# Altium project WiWi_USBStick.PrjPcb (part 1 of 5)
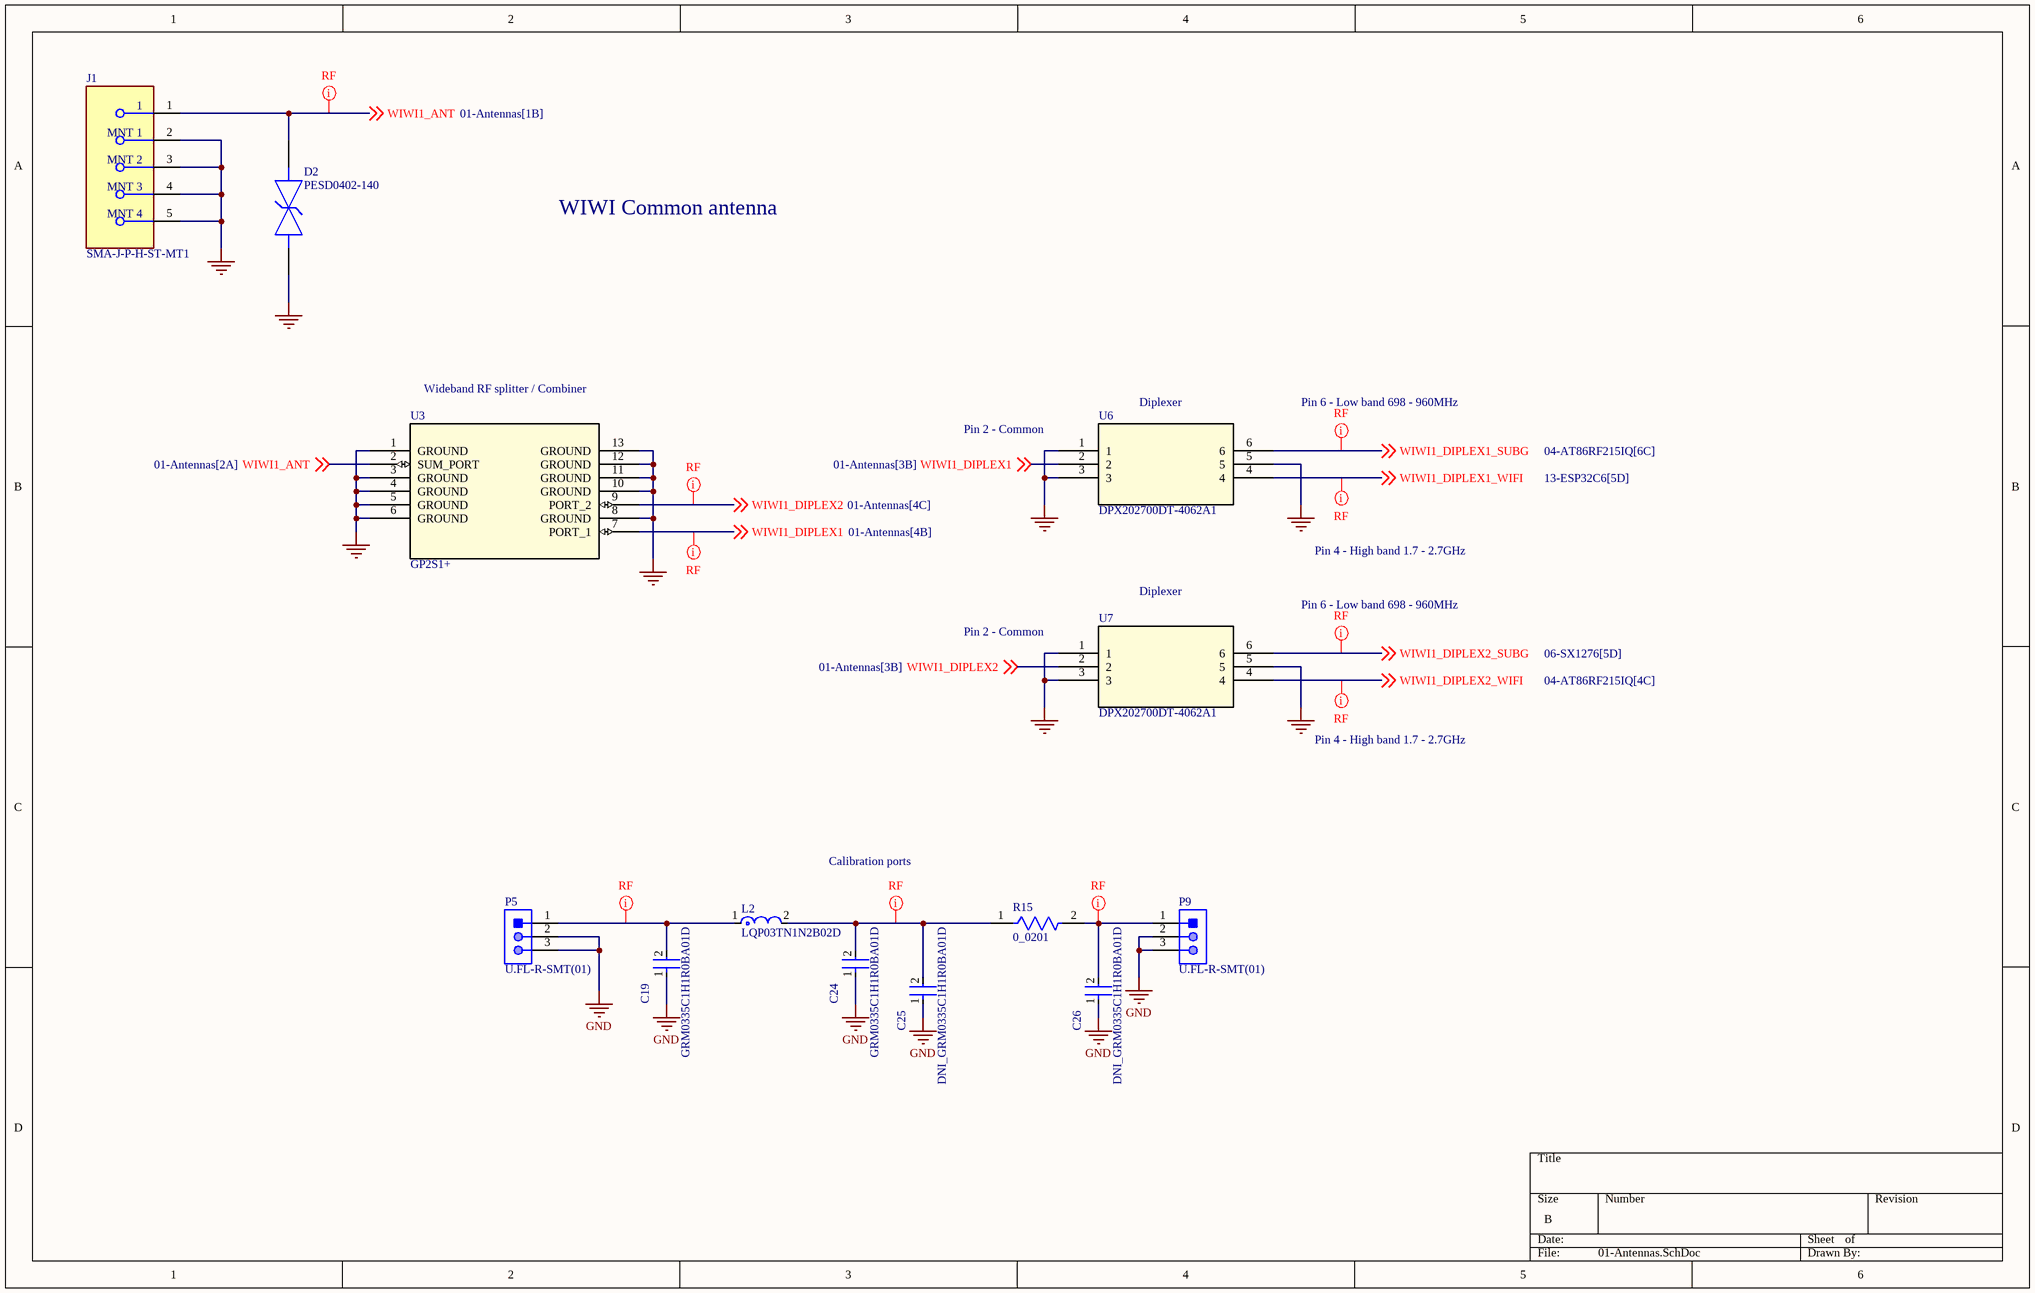
[diagram p0: 01-Antennas.SchDoc]
prjCompanyName: Meta Platforms Technologies, LLC.; prjContactAddress1: 9845 Willows Road NE; prjContactAddress2: Redmond, WA 98052; prjContactEmail: Contact Email; prjContactPhone: (...)-...-....; prjElectricalEngineer: Electical Engineer; prjElectricalEngineerEmail: Electical Engineer Email; prjLayoutEngineer: Layout Engineer; prjLayoutEngineerEmail: Layout Engineer Email; prjMechanicalEngineer: Mechanical Engineer; prjMechanicalEngineerEmail: Mechanical Engineer Email; prjPCB_IPN: 844-XXXXX-XX; prjPCB_Name: PCB Name; prjPCB_Revision: X1; prjProjectName: Project Name; prjSchematic_IPN: 846-XXXXX-XX; prjSchematic_Revision: X1; XprjPCBA_IPN: Set v_prjPCBA_IPN in variant parameters; XprjPCBA_Revision: Set v_prjPCBA_Revision in variant parameters
14 sheets, 599 parts. Net scope: global (net labels, ports and power ports of the same name join across sheets).
Board file: WiWi_USBStick_V1.PcbDoc
Sheets:
  01-Antennas.SchDoc
  02-USB3.SchDoc
  03-FT601.SchDoc
  04-USB2_Hub_BoardControlPeripherals.SchDoc
  04-AT86RF215IQ.SchDoc
  06-SX1276.SchDoc
  07-TCXO_Crystal.SchDoc
  13-ESP32C6.SchDoc
  14-DPLL_1.SchDoc
  15-DPLL_2.SchDoc
  16-ECP5_FPGA_1.SchDoc
  17-ECP5_FPGA_2.SchDoc
  11-Power.SchDoc
  12-FPGA_Power.SchDoc

## Sheet 01-Antennas.SchDoc
size B; SheetNumber: 1; SheetTotal: 14; SPICEModelCacheELOCFEDZ: <root> / <DocumentId>ELOCFEDZ</DocumentId> / </root>

### Parts
C19  GRM0335C1H1R0BA01D  [FP-GRM033-0_03-IPC_C]
C24  GRM0335C1H1R0BA01D  [FP-GRM033-0_03-IPC_C]
C25  DNI_GRM0335C1H1R0BA01D  [FP-GRM033-0_03-IPC_C]  (no BOM)
C26  DNI_GRM0335C1H1R0BA01D  [FP-GRM033-0_03-IPC_C]  (no BOM)
D2  PESD0402-140  [FP-PESD0402-MFG]
J1  SMA-J-P-H-ST-MT1  [FP-SMA-J-P-H-ST-MT1-MFG]
L2  LQP03TN1N2B02D  [FP-LQP03TG_02-IPC_A]
P5  U.FL-R-SMT(01)  [HRS-U.FL-R-SMT(10)_V]
P9  U.FL-R-SMT(01)  [HRS-U.FL-R-SMT(10)_V]
R15  0_0201  [FP-RC_L0201-MFG]
U3  GP2S1+  [DQ1225_MNC]
U6  DPX202700DT-4062A1  [RF_4060A1_TDK]
U7  DPX202700DT-4062A1  [RF_4060A1_TDK]

### Nets
GND: C19.1 C24.1 C25.1 C26.1 D2.1 J1.2(MNT_1) J1.3(MNT_2) J1.4(MNT_3) J1.5(MNT_4) P5.2 P5.3 P9.2 P9.3 U3.1(GROUND) U3.3(GROUND) U3.4(GROUND) U3.5(GROUND) U3.6(GROUND) U3.8(GROUND) U3.10(GROUND) U3.11(GROUND) U3.12(GROUND) U3.13(GROUND) U6.1 U6.3 U6.5 U7.1 U7.3 U7.5
WIWI1_ANT: D2.2 J1.1 U3.2(SUM_PORT) ; off-sheet WIWI1_ANT
WIWI1_DIPLEX1: U3.7(PORT_1) U6.2 ; off-sheet WIWI1_DIPLEX1
WIWI1_DIPLEX1_SUBG: U6.6 ; off-sheet WIWI1_DIPLEX1_SUBG
WIWI1_DIPLEX1_WIFI: U6.4 ; off-sheet WIWI1_DIPLEX1_WIFI
WIWI1_DIPLEX2: U3.9(PORT_2) U7.2 ; off-sheet WIWI1_DIPLEX2
WIWI1_DIPLEX2_SUBG: U7.6 ; off-sheet WIWI1_DIPLEX2_SUBG
WIWI1_DIPLEX2_WIFI: U7.4 ; off-sheet WIWI1_DIPLEX2_WIFI
NetC19_2: C19.2 L2.1 P5.1
NetC24_2: C24.2 C25.2 L2.2 R15.1
NetC26_2: C26.2 P9.1 R15.2

### Layout directives
net class RF: NetC19_2, NetC24_2, NetC26_2, WIWI1_ANT, WIWI1_DIPLEX1, WIWI1_DIPLEX1_SUBG, WIWI1_DIPLEX1_WIFI, WIWI1_DIPLEX2, WIWI1_DIPLEX2_SUBG, WIWI1_DIPLEX2_WIFI

### Notes on the sheet
- WIWI Common antenna
- Wideband RF splitter / Combiner
- (near U6) Pin 2 - Common
- (near U6) Diplexer
- Pin 6 - Low band 698 - 960MHz
- Pin 4 - High band 1.7 - 2.7GHz
- (near U7) Pin 2 - Common
- Diplexer
- Calibration ports

### Library data of the parts
C19 C24-C26 = CMP-2010-01509-2: Chip Multilayer Ceramic Capacitors for General Purpose, 0201, 1.0pF, C0G, 30ppm/°C, 0.1pF, 50V; Capacitance: 1pF; Termination: SMD/SMT; Depth: 0.3mm; Mount: Surface Mount; Case Code (Metric): 0603; Length: 0.024inch; Voltage Rating: 50V; Voltage Rating (DC): 50V; Width: 0.012inch; Lead Free: Lead Free; Dielectric: C0G; Thickness: 0.013inch; Packaging: Tape and Reel; Case Code (Imperial): 0201; Case/Package: 0201; Package Quantity: 15000; Min Operating Temperature: -55°C; Max Operating Temperature: 125°C
D2 = CMP-08607-000011-1: TVS DIODE 14V 40V 0402; Manufacturer: Littelfuse Inc.; Automotive Grade: Grade 1; Capacitance: 0.25pF; Value: 0.25pF; Direction: Bidirectional; Number Of Channels: 1; Temperature Range Low: -55°C; Lead Free: Yes; Temperature: -55°C to +125°C; Digikey Description: TVS DIODE 14V 40V 0402; Automotive: Yes; Device Class L2: TVS Diodes; Reverse Standoff Voltage: 14V; Device Class L1: Circuit Protection; Ipc Land Pattern Name: DIOC10050X33; Manufacturer Part Number: PESD0402-140; Breakdown Voltage: 14V; Height: 0.43mm; Clamping Voltage: 40V; RoHS: TRUE; Temperature Range High: +125°C; Device Class L3: unset; Octopart: https://octopart.com/pesd0402-140-littelfuse-74215061; Package: PESD0402; ComponentLink2URL: https://www.littelfuse.com/~/media/electronics/datasheets/polymer_esd_suppressors/littelfuse_polymer_esd_suppressor_pesd_catalog_datasheet.pdf.pdf; Category: Diode; ComponentLink2Description: Datasheet
J1 = CMP-02754-000007-1: CONN SMA JACK STR 50 OHM SMD; Dielectric Material: PTFE; Voltage Rating: 335V; Body Material: Brass; Center Contact Plating: Gold; Impedance: 50R; Number of Ports: 1; Max Frequency: 20GHz; Mount: Surface Mount; Contact Plating: Gold; Housing Color: Gold; Series: -; Fastening Type: Threaded; Packaging: Bulk; Connector Type: SMA; Contact Material: Copper Alloy; Body Plating: Gold; Case/Package: SMA; Termination: Solder; RoHS Compliant: No; Min Operating Temperature: -65°C; Max Operating Temperature: 125°C
L2 = CMP-06042-001577-1: Film type RF Inductor 1.2nH ±0.1nH 750mA 0.1Ω 0201 (0603); DC Resistance (DCR): 100mR; Current: 600mA; Core Material: Non-Magnetic; Shielding: Unshielded; Q Factor: 14; Test Frequency: 500MHz; Self Resonant Frequency: 6GHz; Inductance: 1.2nH; Mount: Surface Mount; Package Quantity: 15000; Length: 0.024inch; Resistor Type: Thin Film; Min Operating Temperature: -55°C; Depth: 0.33mm; Height: 0.012inch; Max DC Current: 750mA; Width: 0.012inch; Case/Package: 0201; Case Code (Imperial): 0201; Lead Free: Lead Free; Military Standard: Not; Termination: SMD/SMT; Max Operating Temperature: 125°C; DC Current: 750mA; Packaging: Tape and Reel; Case Code (Metric): 0603; Height - Seated (Max): 0.013inch; REACH SVHC: No SVHC; Radiation Hardening: No; Current Rating: 750mA
P5 P9 = CMP-2000-05151-1: CONN RECPT ULTRA-MINI COAX SMD; Manufacturer: Hirose Electric; Centre Contact Resistance: 25mohm; Voltage Rating V AC: 60V; Female Contact Material: PhosphorBronze; Contact Resistance: 10mohm; Male Contact Material: Brass; Connector Type: UFLCoaxial; Connector Mounting: PCB; Impedance: 50ohm; Insulation Resistance: 500Mohm; Secondary Insulation Material: PBT; Frequency Max: 6GHz; Body Plating: Silver; External Length / Height: 2.5mm; Approval Category: UL94V-0; Female Contact Plating: Gold; Connector Mounting Orientation: PCBoard; VSWR: 1.3; Coaxial Termination: Solder; Body Style: StraightJack; SVHC: NoSVHC(18-Jun-2012); Jacket Material: LCP; Package Reference: U.FL-R-SMT(10); Datasheet Version: Feb-04; Outer Contact Resistance: 10mohm; Contact Plating: Gold; Mounting Type: PCBoard; Flammability Rating: UL94V-0; Operating Frequency Max: 6GHz; Termination Method: Solder; Male Contact Plating: Gold; Package Description: 3-Pin Surface Mount Device, Body 2.6 x 2.6 mm; Operating Temperature Min: -40degC; Manufacturer URL: https://www.hirose.com; Operating Temperature Max: 90degC; Contact Material: PhosphorBronze; Datasheet URL: http://www.farnell.com/datasheets/91524.pdf; Material: PhosphorBronze
R15 = CMP-03412-023265-1: RES SMD 0 OHM JUMPER 1/20W 0201; Manufacturer: Yageo; Manufacturer Part Number: RC0201JR-070RL; Power Rating: 50mW; Value: 0Ω; Temperature Coefficient: 200ppm/°C; Voltage Rating: 25V; Tolerance: 5%; Octopart: https://octopart.com/rc0201jr-070rl-yageo-43171986; ComponentLink2URL: http://www.yageo.com/documents/recent/PYu-RC_Group_51_RoHS_L_10.pdf; Device Class L2: Resistors; Series: RC_L; Ipc Land Pattern Name: RESC6030X23; Temperature: -55°C to +125°C; Mouser Description: Thick Film Resistors ZERO OHM JUMPER; Footprint Url: http://www.yageo.com/exep/pages/download/literatures/PYu-R_Mount_10.pdf; RoHS: TRUE; Package: RC_L0201; Device Class L3: Chip SMD Resistors; Temperature Range Low: -55°C; Composition: Thick Film; ComponentLink2Description: Datasheet; Height: 0.26mm; Device Class L1: Passive Components; Category: Res; Resistance: 0Ω; Temperature Range High: +125°C; Automotive: No; Lead Free: Yes; Digikey Description: RES SMD 0 OHM JUMPER 1/20W 0201
U3 = GP2S1+: No Description Available; Mfr_Name: Mini Circuits; Type: RF; RefDes: RefDes
U6 U7 = DPX202700DT-4062A1: No Description Available; Mfr_Name: TDK; RefDes: RefDes; Type: Type

## Sheet 02-USB3.SchDoc
size B; SheetNumber: 2; SheetTotal: 14
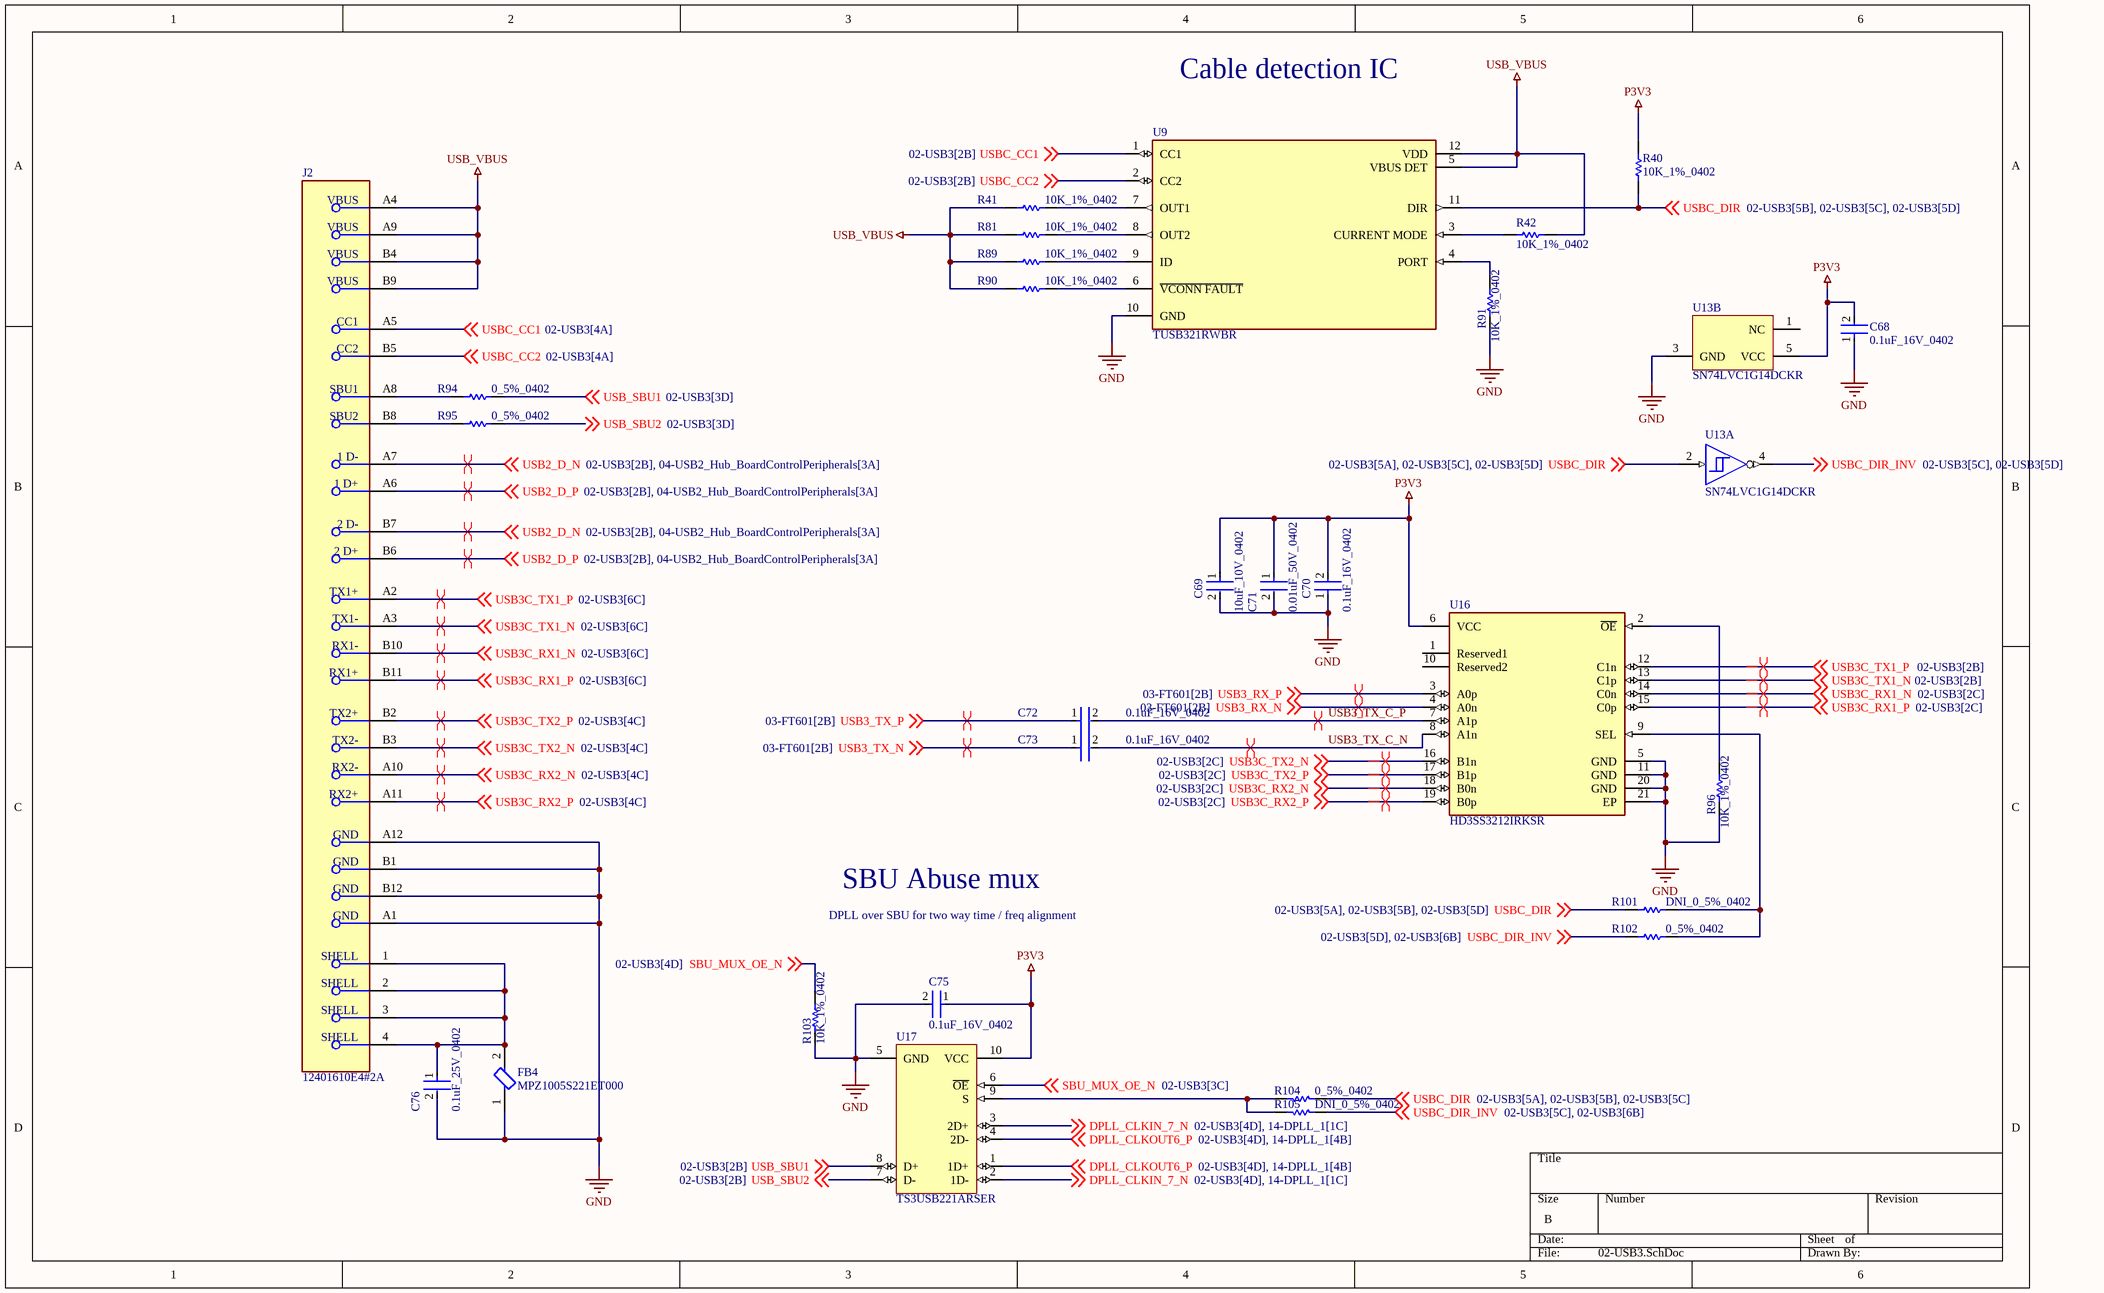
[diagram p1: 02-USB3.SchDoc]

### Parts
C68  0.1uF_16V_0402  [FP-C0402-BB-MFG]
C69  10uF_10V_0402  [FP-CL05A106MP5NUNC-MFG]
C70  0.1uF_16V_0402  [FP-C0402-BB-MFG]
C71  0.01uF_50V_0402  [FP-C0402-BB-MFG]
C72  0.1uF_16V_0402  [FP-C0402-BB-MFG]
C73  0.1uF_16V_0402  [FP-C0402-BB-MFG]
C75  0.1uF_16V_0402  [FP-C0402-BB-MFG]
C76  0.1uF_25V_0402  [FP-CGA2B-IPC_B]
FB4  MPZ1005S221ET000  [FP-MPZ1005-IPC_A]
J2  12401610E4#2A  [FP-12401610E4#2A-MFG]
R40  10K_1%_0402  [RESC1005X40X25NL10T10]
R41  10K_1%_0402  [RESC1005X40X25NL10T10]
R42  10K_1%_0402  [RESC1005X40X25NL10T10]
R81  10K_1%_0402  [RESC1005X40X25NL10T10]
R89  10K_1%_0402  [RESC1005X40X25NL10T10]
R90  10K_1%_0402  [RESC1005X40X25NL10T10]
R91  10K_1%_0402  [RESC1005X40X25NL10T10]
R94  0_5%_0402  [RESC1005X40X25NL05T10]
R95  0_5%_0402  [RESC1005X40X25NL05T10]
R96  10K_1%_0402  [RESC1005X40X25NL10T10]
R101  DNI_0_5%_0402  [RESC1005X40X25NL05T10]  (no BOM)
R102  0_5%_0402  [RESC1005X40X25NL05T10]
R103  10K_1%_0402  [RESC1005X40X25NL10T10]
R104  0_5%_0402  [RESC1005X40X25NL05T10]
R105  DNI_0_5%_0402  [RESC1005X40X25NL05T10]  (no BOM)
U9  TUSB321RWBR  [FP-RWB0012A-MFG]
U13  SN74LVC1G14DCKR  [DCK0005A_L]  (parts A,B of 2)
U16  HD3SS3212IRKSR  [FP-RKS0020A-MFG]
U17  TS3USB221ARSER  [RSE0010A_V]

### Nets
GND: C68.1 C69.2 C70.1 C71.2 C75.2 C76.2 FB4.1 J2.A1(GND) J2.A12(GND) J2.B1(GND) J2.B12(GND) R91.1 R96.1 R103.2 U9.10(GND) U13.3(GND) U16.5(GND) U16.11(GND) U16.20(GND) U16.21(EP) U17.5(GND)
P3V3: C68.2 C69.1 C70.2 C71.1 C75.1 R40.1 U13.5(VCC) U16.6(VCC) U17.10(VCC)
USB_VBUS: J2.A4(VBUS) J2.A9(VBUS) J2.B4(VBUS) J2.B9(VBUS) R41.2 R42.1 R81.2 R89.2 R90.2 U9.5(VBUS_DET) U9.12(VDD)
DPLL_CLKIN_7_N: U17.2(1D-) U17.3(2D+) ; off-sheet DPLL_CLKIN_7_N
DPLL_CLKOUT6_P: U17.1(1D+) U17.4(2D-) ; off-sheet DPLL_CLKOUT6_P
SBU_MUX_OE_N: R103.1 U17.6(~{OE}) ; off-sheet SBU_MUX_OE_N
USB2_D_N: J2.A7(1_D-) J2.B7(2_D-) ; off-sheet USB2_D_N
USB2_D_P: J2.A6(1_D+) J2.B6(2_D+) ; off-sheet USB2_D_P
USB3_RX_N: U16.4(A0n) ; off-sheet USB3_RX_N
USB3_RX_P: U16.3(A0p) ; off-sheet USB3_RX_P
USB3_TX_C_N: C73.2 U16.8(A1n)
USB3_TX_C_P: C72.2 U16.7(A1p)
USB3_TX_N: C73.1 ; off-sheet USB3_TX_N
USB3_TX_P: C72.1 ; off-sheet USB3_TX_P
USB3C_RX1_N: J2.B10(RX1-) U16.14(C0n) ; off-sheet USB3C_RX1_N
USB3C_RX1_P: J2.B11(RX1+) U16.15(C0p) ; off-sheet USB3C_RX1_P
USB3C_RX2_N: J2.A10(RX2-) U16.18(B0n) ; off-sheet USB3C_RX2_N
USB3C_RX2_P: J2.A11(RX2+) U16.19(B0p) ; off-sheet USB3C_RX2_P
USB3C_TX1_N: J2.A3(TX1-) U16.13(C1p) ; off-sheet USB3C_TX1_N
USB3C_TX1_P: J2.A2(TX1+) U16.12(C1n) ; off-sheet USB3C_TX1_P
USB3C_TX2_N: J2.B3(TX2-) U16.16(B1n) ; off-sheet USB3C_TX2_N
USB3C_TX2_P: J2.B2(TX2+) U16.17(B1p) ; off-sheet USB3C_TX2_P
USB_SBU1: R94.2 U17.8(D+) ; off-sheet USB_SBU1
USB_SBU2: R95.2 U17.7(D-) ; off-sheet USB_SBU2
USBC_CC1: J2.A5(CC1) U9.1(CC1) ; off-sheet USBC_CC1
USBC_CC2: J2.B5(CC2) U9.2(CC2) ; off-sheet USBC_CC2
USBC_DIR: R40.2 R101.1 R104.1 U9.11(DIR) U13.2(A) ; off-sheet USBC_DIR
USBC_DIR_INV: R102.1 R105.1 U13.4(Y) ; off-sheet USBC_DIR_INV
NetC76_1: C76.1 FB4.2 J2.1(SHELL) J2.2(SHELL) J2.3(SHELL) J2.4(SHELL)
NetJ2_A8: J2.A8(SBU1) R94.1
NetJ2_B8: J2.B8(SBU2) R95.1
NetR41_1: R41.1 U9.7(OUT1)
NetR42_2: R42.2 U9.3(CURRENT_MODE)
NetR81_1: R81.1 U9.8(OUT2)
NetR89_1: R89.1 U9.9(ID)
NetR90_1: R90.1 U9.6(~{VCONN_FAULT})
NetR91_2: R91.2 U9.4(PORT)
NetR96_2: R96.2 U16.2(~{OE})
NetR101_2: R101.2 R102.2 U16.9(SEL)
NetR104_2: R104.2 R105.2 U17.9(S)

Not connected (* = marked no-connect by the designer): U13 1(NC); U16 1(Reserved1) 10(Reserved2)

### Layout directives
differential pair: USB2_D_N, USB2_D_P, USB3_RX_N, USB3_RX_P, USB3_TX_C_N, USB3_TX_C_P, USB3_TX_N, USB3_TX_P, USB3C_RX1_N, USB3C_RX1_P, USB3C_RX2_N, USB3C_RX2_P, USB3C_TX1_N, USB3C_TX1_P, USB3C_TX2_N, USB3C_TX2_P

### Notes on the sheet
- Cable detection IC
- SBU Abuse mux
- DPLL over SBU for two way time / freq alignment

### Library data of the parts
C68 C70 C72 C73 C75 = CMP-1034-02068-3: CAP CER 0.1UF 16V 5% X7R 0402; Manufacturer: Kemet; Manufacturer Part Number: C0402C104J4RACTU; Value: 0.10 μF; Temperature Coefficient: 15%; Tolerance: 0.05; Material: Ceramic; ComponentLink2URL: https://content.kemet.com/datasheets/KEM_C1002_X7R_SMD.pdf; Automotive: No; Device Class L2: Capacitors; Temperature: -55°C to +125°C; RoHS: TRUE; Voltage Rating: 16 V; ComponentLink2Description: Datasheet; Device Class L3: Ceramic Capacitors; Temperature Range Low: -55°C; Ipc Land Pattern Name: CAPC10050X50; Device Class L1: Passive Components; Temperature Range High: +125°C; Package: C0402-BB; Capacitance: 0.10 μF; Category: Cap; Mouser Description: CAP CER 0.1UF 16V X7R 0402; Height: 0.55mm; Digikey Description: CAP CER 0.1UF 16V 5% X7R 0402; Octopart: https://octopart.com/c0402c104j4ractu-kemet-12573893; Temperature Characteristic: X7R; Lead Free: Yes
C69 = CMP-13271-000002-1: CAP CER 10UF 10V X5R 0402; Manufacturer Part Number: CL05A106MP5NUNC; Manufacturer: Samsung; Temperature Coefficient: 15%; Tolerance: 20%; Material: Ceramic; Octopart: https://octopart.com/cl05a106mp5nunc-samsung-22457395; Voltage Rating: 10V; RoHS: TRUE; Value: 10uF; Height: 0.7mm; Digikey Description: CAP CER 10UF 10V X5R 0402; Automotive: No; Package: CL05A106MP5NUNC; Device Class L1: Passive Components; Capacitance: 10uF; Temperature Range High: +85°C; ComponentLink2Description: Datasheet; Device Class L2: Capacitors; Temperature Characteristic: X5R; Temperature: -55°C to +85°C; ComponentLink2URL: http://www.samsungsem.com/kr/support/product-search/mlcc/__icsFiles/afieldfile/2019/05/10/19-CL05A106MP5NUNC.pdf; Device Class L3: Ceramic Capacitors; Category: Cap; Temperature Range Low: -55°C; Ipc Land Pattern Name: CAPC10050X50; Lead Free: Yes
C71 = CMP-2008-02109-2: CAP CER 10000PF 50V X7R 0402; Manufacturer: Kemet; Manufacturer Part Number: C0402C103K5RACTU; Temperature Coefficient: 15%; Tolerance: 0.1; Value: 10,000 pF; Material: Ceramic; Device Class L3: Ceramic Capacitors; Digikey Description: CAP CER 10000PF 50V X7R 0402; Height: 0.55mm; Temperature Range Low: -55°C; Package: C0402-BB; ComponentLink2URL: https://content.kemet.com/datasheets/KEM_C1002_X7R_SMD.pdf; Lead Free: Yes; Mouser Description: Capacitor; Ceramic; Cap; .010uF; Tol 10%; SMT; Vol-Rtg 50V; X7R; Tape and Reel; Ipc Land Pattern Name: CAPC10050X50; Temperature Range High: +125°C; Device Class L1: Passive Components; Category: Cap; Octopart: https://octopart.com/c0402c103k5ractu-kemet-95985; Temperature Characteristic: X7R; Automotive: No; Device Class L2: Capacitors; ComponentLink2Description: Datasheet; Voltage Rating: 50 V; Capacitance: 10,000 pF; RoHS: TRUE; Temperature: -55°C to +125°C
C76 = CMP-2000-06086-2: Cap Ceramic 100nF 25V X7R 10% Pad SMD 0402 +125°C Automotive T/R; Lead Free: Lead Free; Termination: SMD/SMT; Voltage Rating: 25V; Voltage: 25V; Composition: Ceramic; Case/Package: 0402; Mount: Surface Mount; Voltage Rating (DC): 25V; Tolerance: 10%; Length: 1mm; Width: 0.02inch; REACH SVHC: No SVHC; Max Operating Temperature: 125°C; Case Code (Metric): 1005; Case Code (Imperial): 0402; Package Quantity: 1; Depth: 0.5mm; Min Operating Temperature: -55°C; Thickness: 0.022inch; Capacitance: 100nF; Height: 0.5mm; Dielectric: X7R; Packaging: Tape and Reel; Weight: 2.3E-05oz; Ratings: AEC-Q200
FB4 = CMP-08257-000226-1: Power line Ferrite Bead 220Ω @ 100MHz 0.9A DCR 0.22Ω SMD 0402; Max Current Rating: 900mA; Impedance: 220R; Number of Lines: 1; DC Resistance (DCR): 220mR; Tolerance: 25%; Mount: Surface Mount; Case Code (Metric): 1005; Height: 0.022inch; Min Operating Temperature: -55°C; Max Operating Temperature: 125°C; RoHS Compliant: Yes; Length: 0.039inch; Width: 0.02inch; Case Code (Imperial): 0402; Case/Package: 0402; Package Quantity: 10000; Max DC Current: 900mA; Core Material: Ferrite; Packaging: Tape and Reel
J2 = CMP-02355-000003-1: CONN RCP USB3.1 TYPEC 24P SMD RA; Connector Type: USB; Number of Contacts: 24; Gender: Receptacle; Packaging: Cut Tape; Mount: Surface Mount; Number of Pins: 24
R40-R42 R81 R89-R91 R96 R103 = CMP-2002-04694-1: Manufacturer: Bourns; Part Number: CR0402-FX-1002GLF
R94 R95 R101 R102 R104 R105 = CMP-2002-06457-1: Manufacturer: Panasonic; Part Number: ERJ-U020R00X
U9 = CMP-04877-000009-1: IC INTERFACE SPECIALIZED 12X2QFN; Number of Ports: 1; Max Supply Voltage: 5.5V; Min Supply Voltage: 4.5V; USB Standard: USB 3.1; Max Operating Temperature: 70°C; Mount: Surface Mount; Number of Pins: 12; Lead Free: Lead Free; Min Operating Temperature: 0°C; REACH SVHC: No SVHC; Packaging: Tape and Reel; RoHS Compliant: Yes; Contact Plating: Gold
U13 = CMP-0859-00440-4: Single Schmitt-Trigger Inverter, DCK0005A, LARGE T&R; Manufacturer: Texas Instruments; Output Drive (IOL/IOH)(Max)(mA): 32/-32; Schmitt Trigger: Yes; Logic: Inverting; Bits(#): 1; Rating: Catalog; tpd @ Nom Voltage(Max)(ns): 11,6.5,5.5,5; Voltage(Nom)(V): 1.8,2.5,3.3,5; Output Type: CMOS; VCC(Min)(V): 1.65; ICC @ Nom Voltage(Max)(mA): 0.01; Input Type: CMOS/TTL; F @ Nom Voltage(Max)(Mhz): 150; VCC(Max)(V): 5.5; Sub-Family: Inverting Buffer/Driver; 3-State Output: No; Technology Family: LVC; PackageReference: DCK0005A; Operating Temperature Range(C): -40 to 125,-40 to 85; Generic Part Number: SN74LVC1G14; DatasheetVersion: SCES218W
U16 = CMP-04877-000012-1: IC MUX 2:1 8 OHM 20VQFN; USB Standard: USB 3.1; Min Supply Voltage: 3V; Max Supply Voltage: 3.6V; Data Rate: 480Mbps; Number of Ports: 2; Bandwidth: 8GHz; REACH SVHC: No SVHC; Lead Free: Lead Free; Max Operating Temperature: 85°C; Packaging: Tape and Reel; Case/Package: VQFN; Number of Pins: 20; Min Operating Temperature: -40°C
U17 = CMP-0309-00017-2: ESD Protected,High-Speed USB 2.0 (480-Mbps) 1:2 Multiplexer / Demultiplexer Switch, 1:2 Mux / Demux, 6 ohm RON, 2.5 to 3.3V, -40 to 85 degC, 10-Pin UQFN (RSE), Green (RoHS & no Sb/Br); Manufacturer: Texas Instruments; tpd max(ns): 0.25; RON Mis-match(Max)(Ohms): 0.2; OFF Time(Max)(ns): 12; Architecture: "1","2 mux/demux"; IL OFF(Max)(nA): 2; SubFamily: USB Switch; ESD HBM(kV): +/-7; ron(max)(ohms): 6; ON Time(Max)(ns): 30; Bandwidth(MHz): 900; RON Flatness(Max)(Ohms): 1; Vcc range(V): 2.3 to 3.6; Mounting Technology: Surface Mount; ComponentLink2URL: http://www.ti.com/lit/ml/mpqf186c/mpqf186c.pdf; PackageDescription: 10-Leads Plastic Quad Flatpack No-Lead, 2 x 1.5 x 0.55 mm Body, 0.5 mm Pitch; ComponentLink1URL: http://www.ti.com/general/docs/lit/getliterature.tsp?genericPartNumber=TS3USB221A&fileType=pdf; PackageReference: RSE0010A; ComponentLink2Description: Package Specification; PartNumber: TS3USB221ARSER; Code_JEDEC: MO-288-UEFD; DatasheetVersion: SCDS277; ComponentLink1Description: Datasheet; Eco-Plan: Green (RoHS & no Sb/Br); Number of Channels: 2; PackageVersion: revD, Jan-2011; ICC(uA): 30

## Sheet 03-FT601.SchDoc
size B; SheetNumber: 3; SheetTotal: 14
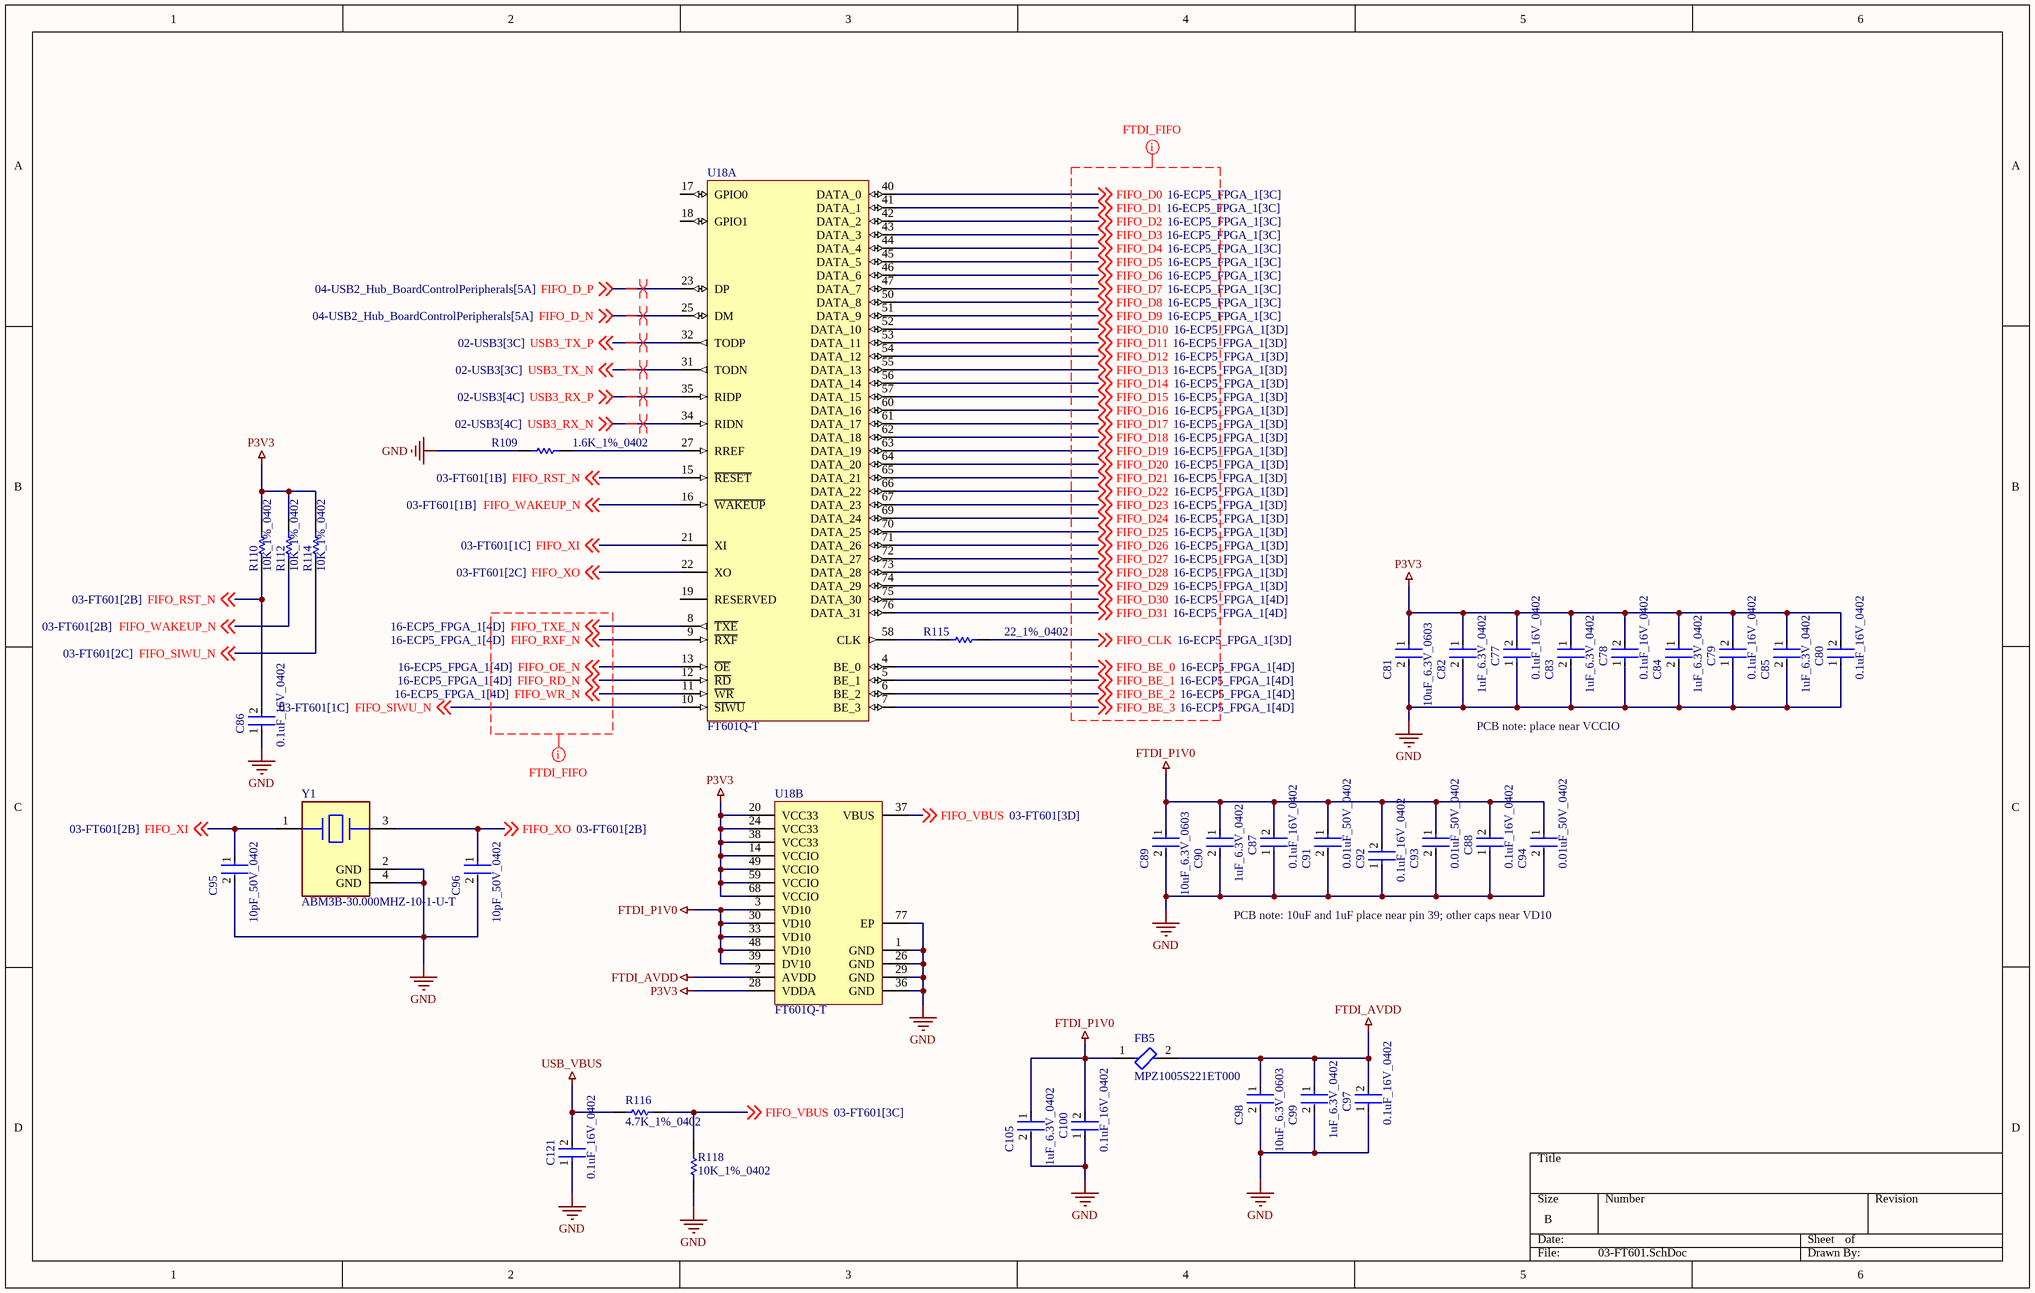
[diagram p2: 03-FT601.SchDoc]

### Parts
C77  0.1uF_16V_0402  [FP-C0402-BB-MFG]
C78  0.1uF_16V_0402  [FP-C0402-BB-MFG]
C79  0.1uF_16V_0402  [FP-C0402-BB-MFG]
C80  0.1uF_16V_0402  [FP-C0402-BB-MFG]
C81  10uF_6.3V_0603  [FP-GRM188-0_1-e0_2_0_55-IPC_A]
C82  1uF_6.3V_0402  [FP-CC0402-MFG]
C83  1uF_6.3V_0402  [FP-CC0402-MFG]
C84  1uF_6.3V_0402  [FP-CC0402-MFG]
C85  1uF_6.3V_0402  [FP-CC0402-MFG]
C86  0.1uF_16V_0402  [FP-C0402-BB-MFG]
C87  0.1uF_16V_0402  [FP-C0402-BB-MFG]
C88  0.1uF_16V_0402  [FP-C0402-BB-MFG]
C89  10uF_6.3V_0603  [FP-GRM188-0_1-e0_2_0_55-IPC_A]
C90  1uF_6.3V_0402  [FP-CC0402-MFG]
C91  0.01uF_50V_0402  [FP-C0402-BB-MFG]
C92  0.1uF_16V_0402  [FP-C0402-BB-MFG]
C93  0.01uF_50V_0402  [FP-C0402-BB-MFG]
C94  0.01uF_50V_0402  [FP-C0402-BB-MFG]
C95  10pF_50V_0402  [FP-C0402-BB-MFG]
C96  10pF_50V_0402  [FP-C0402-BB-MFG]
C97  0.1uF_16V_0402  [FP-C0402-BB-MFG]
C98  10uF_6.3V_0603  [FP-GRM188-0_1-e0_2_0_55-IPC_A]
C99  1uF_6.3V_0402  [FP-CC0402-MFG]
C100  0.1uF_16V_0402  [FP-C0402-BB-MFG]
C105  1uF_6.3V_0402  [FP-CC0402-MFG]
C121  0.1uF_16V_0402  [FP-C0402-BB-MFG]
FB5  MPZ1005S221ET000  [FP-MPZ1005-IPC_A]
R109  1.6K_1%_0402  [RESC1005X40X25LL05T05]
R110  10K_1%_0402  [RESC1005X40X25NL10T10]
R112  10K_1%_0402  [RESC1005X40X25NL10T10]
R114  10K_1%_0402  [RESC1005X40X25NL10T10]
R115  22_1%_0402  [RESC1005X40X25ML05T05]
R116  4.7K_1%_0402  [RESC1005X40X25NL05T10]
R118  10K_1%_0402  [RESC1005X40X25NL10T10]
U18  FT601Q-T  [FTDI-QFN-76_M]  (parts A,B of 2)
Y1  ABM3B-30.000MHZ-10-1-U-T  [FP-ABM3B-MFG]

### Nets
FTDI_AVDD: C97.2 C98.1 C99.1 FB5.2 U18.2(AVDD)
FTDI_P1V0: C87.2 C88.2 C89.1 C90.1 C91.1 C92.2 C93.1 C94.1 C100.2 C105.1 FB5.1 U18.3(VD10) U18.30(VD10) U18.33(VD10) U18.39(DV10) U18.48(VD10)
GND: C77.1 C78.1 C79.1 C80.1 C81.2 C82.2 C83.2 C84.2 C85.2 C86.1 C87.1 C88.1 C89.2 C90.2 C91.2 C92.1 C93.2 C94.2 C95.2 C96.2 C97.1 C98.2 C99.2 C100.1 C105.2 C121.1 R109.1 R118.2 U18.1(GND) U18.26(GND) U18.29(GND) U18.36(GND) U18.77(EP) Y1.2(GND) Y1.4(GND)
P3V3: C77.2 C78.2 C79.2 C80.2 C81.1 C82.1 C83.1 C84.1 C85.1 R110.1 R112.1 R114.1 U18.14(VCCIO) U18.20(VCC33) U18.24(VCC33) U18.28(VDDA) U18.38(VCC33) U18.49(VCCIO) U18.59(VCCIO) U18.68(VCCIO)
USB_VBUS: C121.2 R116.1
FIFO_BE_0: U18.4(BE_0) ; off-sheet FIFO_BE_0
FIFO_BE_1: U18.5(BE_1) ; off-sheet FIFO_BE_1
FIFO_BE_2: U18.6(BE_2) ; off-sheet FIFO_BE_2
FIFO_BE_3: U18.7(BE_3) ; off-sheet FIFO_BE_3
FIFO_CLK: R115.2 ; off-sheet FIFO_CLK
FIFO_D0: U18.40(DATA_0) ; off-sheet FIFO_D0
FIFO_D1: U18.41(DATA_1) ; off-sheet FIFO_D1
FIFO_D2: U18.42(DATA_2) ; off-sheet FIFO_D2
FIFO_D3: U18.43(DATA_3) ; off-sheet FIFO_D3
FIFO_D4: U18.44(DATA_4) ; off-sheet FIFO_D4
FIFO_D5: U18.45(DATA_5) ; off-sheet FIFO_D5
FIFO_D6: U18.46(DATA_6) ; off-sheet FIFO_D6
FIFO_D7: U18.47(DATA_7) ; off-sheet FIFO_D7
FIFO_D8: U18.50(DATA_8) ; off-sheet FIFO_D8
FIFO_D9: U18.51(DATA_9) ; off-sheet FIFO_D9
FIFO_D10: U18.52(DATA_10) ; off-sheet FIFO_D10
FIFO_D11: U18.53(DATA_11) ; off-sheet FIFO_D11
FIFO_D12: U18.54(DATA_12) ; off-sheet FIFO_D12
FIFO_D13: U18.55(DATA_13) ; off-sheet FIFO_D13
FIFO_D14: U18.56(DATA_14) ; off-sheet FIFO_D14
FIFO_D15: U18.57(DATA_15) ; off-sheet FIFO_D15
FIFO_D16: U18.60(DATA_16) ; off-sheet FIFO_D16
FIFO_D17: U18.61(DATA_17) ; off-sheet FIFO_D17
FIFO_D18: U18.62(DATA_18) ; off-sheet FIFO_D18
FIFO_D19: U18.63(DATA_19) ; off-sheet FIFO_D19
FIFO_D20: U18.64(DATA_20) ; off-sheet FIFO_D20
FIFO_D21: U18.65(DATA_21) ; off-sheet FIFO_D21
FIFO_D22: U18.66(DATA_22) ; off-sheet FIFO_D22
FIFO_D23: U18.67(DATA_23) ; off-sheet FIFO_D23
FIFO_D24: U18.69(DATA_24) ; off-sheet FIFO_D24
FIFO_D25: U18.70(DATA_25) ; off-sheet FIFO_D25
FIFO_D26: U18.71(DATA_26) ; off-sheet FIFO_D26
FIFO_D27: U18.72(DATA_27) ; off-sheet FIFO_D27
FIFO_D28: U18.73(DATA_28) ; off-sheet FIFO_D28
FIFO_D29: U18.74(DATA_29) ; off-sheet FIFO_D29
FIFO_D30: U18.75(DATA_30) ; off-sheet FIFO_D30
FIFO_D31: U18.76(DATA_31) ; off-sheet FIFO_D31
FIFO_D_N: U18.25(DM) ; off-sheet FIFO_D_N
FIFO_D_P: U18.23(DP) ; off-sheet FIFO_D_P
FIFO_OE_N: U18.13(~{OE}) ; off-sheet FIFO_OE_N
FIFO_RD_N: U18.12(~{RD}) ; off-sheet FIFO_RD_N
FIFO_RST_N: C86.2 R110.2 U18.15(~{RESET}) ; off-sheet FIFO_RST_N
FIFO_RXF_N: U18.9(~{RXF}) ; off-sheet FIFO_RXF_N
FIFO_SIWU_N: R114.2 U18.10(~{SIWU}) ; off-sheet FIFO_SIWU_N
FIFO_TXE_N: U18.8(~{TXE}) ; off-sheet FIFO_TXE_N
FIFO_VBUS: R116.2 R118.1 U18.37(VBUS) ; off-sheet FIFO_VBUS
FIFO_WAKEUP_N: R112.2 U18.16(~{WAKEUP}) ; off-sheet FIFO_WAKEUP_N
FIFO_WR_N: U18.11(~{WR}) ; off-sheet FIFO_WR_N
FIFO_XI: C95.1 U18.21(XI) Y1.1 ; off-sheet FIFO_XI
FIFO_XO: C96.1 U18.22(XO) Y1.3 ; off-sheet FIFO_XO
USB3_RX_N: U18.34(RIDN) ; off-sheet USB3_RX_N
USB3_RX_P: U18.35(RIDP) ; off-sheet USB3_RX_P
USB3_TX_N: U18.31(TODN) ; off-sheet USB3_TX_N
USB3_TX_P: U18.32(TODP) ; off-sheet USB3_TX_P
NetR109_2: R109.2 U18.27(RREF)
NetR115_1: R115.1 U18.58(CLK)

Not connected (* = marked no-connect by the designer): U18 17(GPIO0) 18(GPIO1) 19(RESERVED)

### Layout directives
mark named FTDI_FIFO: FIFO_BE_0, FIFO_BE_1, FIFO_BE_2, FIFO_BE_3, FIFO_CLK, FIFO_D0, FIFO_D1, FIFO_D2, FIFO_D3, FIFO_D4, FIFO_D5, FIFO_D6, FIFO_D7, FIFO_D8, FIFO_D9, FIFO_D10, FIFO_D11, FIFO_D12, FIFO_D13, FIFO_D14, FIFO_D15, FIFO_D16, FIFO_D17, FIFO_D18, FIFO_D19, FIFO_D20, FIFO_D21, FIFO_D22, FIFO_D23, FIFO_D24, FIFO_D25, FIFO_D26, FIFO_D27, FIFO_D28, FIFO_D29, FIFO_D30, FIFO_D31, FIFO_OE_N, FIFO_RD_N, FIFO_RXF_N, FIFO_TXE_N, FIFO_WR_N
differential pair: FIFO_D_N, FIFO_D_P, USB3_RX_N, USB3_RX_P, USB3_TX_N, USB3_TX_P

### Notes on the sheet
- PCB note: place near VCCIO
- PCB note: 10uF and 1uF place near pin 39; other caps near VD10

### Library data of the parts
C77-C80 C86-C88 C92 C97 C100 C121 = CMP-1034-02068-3: as C68 on sheet 02-USB3; ComponentLink2URL: https://content.kemet.com/datasheets/KEM_C1002_X7R_SMD.pdf; Automotive: No; Device Class L2: Capacitors; Temperature: -55°C to +125°C; RoHS: TRUE; Voltage Rating: 16 V; ComponentLink2Description: Datasheet; Device Class L3: Ceramic Capacitors; Temperature Range Low: -55°C; Ipc Land Pattern Name: CAPC10050X50; Device Class L1: Passive Components; Temperature Range High: +125°C; Package: C0402-BB; Capacitance: 0.10 μF; Category: Cap; Mouser Description: CAP CER 0.1UF 16V X7R 0402; Height: 0.55mm; Digikey Description: CAP CER 0.1UF 16V 5% X7R 0402; Octopart: https://octopart.com/c0402c104j4ractu-kemet-12573893; Temperature Characteristic: X7R; Lead Free: Yes
C81 C89 C98 = CMP-2006-02792-2: Chip Multilayer Ceramic Capacitors for General Purpose, 0603, 10uF, X5R, 15%, 20%, 6.3V; Packaging: Tape and Reel; Voltage Rating (DC): 6.3V; Width: 0.031inch; Termination: SMD/SMT; Dielectric: X5R; Package Quantity: 4000; Voltage Rating: 6.3V; Capacitance: 10uF; Case/Package: 0603; Min Operating Temperature: -55°C; Voltage: 6.3V; Length: 1.6mm; Thickness: 0.035inch; Lead Free: Lead Free; Depth: 0.8mm; Case Code (Imperial): 0603; Max Operating Temperature: 85°C; Material: Ceramic; Height: 0.8mm; Tolerance: 20%; Mount: Surface Mount; REACH SVHC: No SVHC; Radiation Hardening: No; Case Code (Metric): 1608
C82-C85 C90 C99 C105 = CMP-2100-03591-2: CAP CER 1UF 6.3V X5R 0402; Manufacturer: YAGEO; Manufacturer Part Number: CC0402KRX5R5BB105; Automotive Grade: NA; Material: Ceramic; Tolerance: 0.1; Temperature Coefficient: 30ppm/°C; Voltage Rating: 6.3 V; Temperature Range Low: -55°C; Digikey Description: CAP CER 1UF 6.3V X5R 0402; Capacitance: 1 uF; Height: 0.55mm; Automotive: No; ComponentLink2URL: http://www.yageo.com/documents/recent/UPY-GP_NP0_16V-to-50V_16.pdf; Device Class L2: Capacitors; RoHS: TRUE; Temperature Range High: +125°C; Device Class L3: Ceramic Capacitors; Device Class L1: Passive Components; Temperature Characteristic: X5R; Package: CC0402; Octopart: https://octopart.com/cc0402krx5r5bb105-yageo-42244618; ComponentLink2Description: Datasheet; Temperature: -55°C to +125°C; Mouser Description: Multilayer Ceramic Capacitors MLCC - SMD/SMT 1uF 6.3V X5R 10%; Category: Cap; Footprint Url: http://www.yageo.com/exep/pages/download/literatures/UPY-C_GEN_24.pdf; Lead Free: Yes; Ipc Land Pattern Name: CAPC10050X50; Value: 1 uF
C91 C93 C94 = CMP-2008-02109-2: as C71 on sheet 02-USB3; Device Class L3: Ceramic Capacitors; Digikey Description: CAP CER 10000PF 50V X7R 0402; Height: 0.55mm; Temperature Range Low: -55°C; Package: C0402-BB; ComponentLink2URL: https://content.kemet.com/datasheets/KEM_C1002_X7R_SMD.pdf; Lead Free: Yes; Mouser Description: Capacitor; Ceramic; Cap; .010uF; Tol 10%; SMT; Vol-Rtg 50V; X7R; Tape and Reel; Ipc Land Pattern Name: CAPC10050X50; Temperature Range High: +125°C; Device Class L1: Passive Components; Category: Cap; Octopart: https://octopart.com/c0402c103k5ractu-kemet-95985; Temperature Characteristic: X7R; Automotive: No; Device Class L2: Capacitors; ComponentLink2Description: Datasheet; Voltage Rating: 50 V; Capacitance: 10,000 pF; RoHS: TRUE; Temperature: -55°C to +125°C
C95 C96 = CMP-2008-03404-2: Multilayer Ceramic Capacitor, C Series, 10 Pf, - 5%, C0G / Np0, 50 V, 0402 [1005 Metric] Rohs Compliant: Yes; Manufacturer Part Number: C0402C100J5GACTU; Manufacturer: Kemet; Temperature Coefficient: 15%; Voltage Rating: 50 V; Capacitance: 10 pF; Value: 10 pF; Tolerance: 0.05; Automotive: No; Temperature Range High: +125°C; ComponentLink2Description: Datasheet; Material: Ceramic; Lead Free: Yes; ComponentLink2URL: https://content.kemet.com/datasheets/KEM_C1002_X7R_SMD.pdf; Device Class L3: Ceramic Capacitors; RoHS: TRUE; Package: C0402-BB; Temperature: -55°C to +125°C; Temperature Range Low: -55°C; Height: 0.55mm; Mouser Description: Multilayer Ceramic Capacitor, C Series, 10 Pf, - 5%, C0G / Np0, 50 V, 0402 [1005 Metric] Rohs Compliant: Yes; Octopart: https://octopart.com/c0402c100j5gactu-kemet-108448; Digikey Description: Multilayer Ceramic Capacitor, C Series, 10 Pf, - 5%, C0G / Np0, 50 V, 0402 [1005 Metric] Rohs Compliant: Yes; Temperature Characteristic: C0G; Category: Cap; Ipc Land Pattern Name: CAPC10050X50; Device Class L1: Passive Components; Device Class L2: Capacitors
FB5 = CMP-08257-000226-1: as FB4 on sheet 02-USB3; Mount: Surface Mount; Case Code (Metric): 1005; Height: 0.022inch; Min Operating Temperature: -55°C; Max Operating Temperature: 125°C; RoHS Compliant: Yes; Length: 0.039inch; Width: 0.02inch; Case Code (Imperial): 0402; Case/Package: 0402; Package Quantity: 10000; Max DC Current: 900mA; Core Material: Ferrite; Packaging: Tape and Reel
R109 = CMP-2002-00708-1: Manufacturer: Panasonic; Part Number: ERJ-2RKF1601X
R110 R112 R114 R118 = CMP-2002-04694-1: as R40 on sheet 02-USB3
R115 = CMP-2002-01135-4: Chip Resistor, 22 Ohm, +/- 1%, 0.1 W, -55 to 155 degC, 0402 (1005 Metric), RoHS, Tape and Reel; PartNumber: ERJ-2RKF22R0X; Case\/Package: 0402; Resistance: 22 Ohm; Power Rating: 100 mW; Voltage Rating: 50 V; ComponentLink2Description: Datasheet; Packaging: Tape and Reel; Weight: 2.8E-05oz; Pins: 2; Case Code (Imperial): 0402; Width: 0.5 mm; ComponentLink2URL: http://industrial.panasonic.com/cdbs/www-data/pdf/RDA0000/AOA0000C86.pdf; Height: 0.35 mm; PackageReference: 0402; REACH SVHC: Yes; Min Operating Temperature: -55 degC; Length: 1 mm; DatasheetVersion: 04/2015; RoHSCompliant: true; Package Quantity: 10000; Case Code (Metric): 1005; PackageDescription: 2-Pin Surface Mount Device, Body 1 x 0.5 mm; ComponentLink1URL: http://www.panasonic.com/; Mount: Surface Mount; Mounting Technology: Surface Mount; Tolerance: 1%; Max Operating Temperature: 155 degC; ComponentLink1Description: Manufacturer URL
R116 = CMP-1011-00586-2: Manufacturer: Yageo / Phycomp; Part Number: RC0402FR-074K7L
U18 = CMP-1736-00001-1: 32 Bit USB 3.0 to FIFO Bridge, 5 Gbps, 3 to 3.6 V, -40 to 85 degC, 76-Pin QFN, Pb-Free, Tray; ComponentLink2Description: Datasheet; Mounting Technology: Surface Mount; ComponentLink1Description: Manufacturer URL; Case/Package: QFN; RoHSCompliant: false; PackageDescription: 76-Pin Quad Flat No-lead Package, Body 9 x 9 mm, Pitch 0.4 mm, Thermal Pad 5.45 x 5.45 mm; ComponentLink2URL: http://www.ftdichip.com/Support/Documents/DataSheets/ICs/DS_FT600Q-FT601Q%20IC%20Datasheet.pdf; DatasheetVersion: Rev. 1.02, 02/2016; PartNumber: FT601Q-T; ComponentLink1URL: http://www.ftdichip.com/
Y1 = CMP-27762-014122-1: Crystal 30MHz ±10ppm 10pF SMD-4 5mm x 3.2mm; ESR (Equivalent Series Resistance): 50R; Packaging: Tape and Reel; Series: ABM3B; Resistor Type: Ceramic; Tolerance: 10ppm; Radiation Hardening: No; Mount: Surface Mount; Max Operating Temperature: 60°C; Operating Frequency: 30 MHz; Min Operating Temperature: -10°C; Length: 5mm; Height: 0.043inch; Frequency: 30MHz; Number of Pins: 4; Frequency Stability: 10ppm; Frequency Tolerance: 10ppm; Case/Package: CSMD; Lead Free: Lead Free; Depth: 3.2mm; Termination: SMD/SMT; Load Capacitance: 10pF; Package Quantity: 1000; Width: 0.126inch

## Sheet 04-USB2_Hub_BoardControlPeripherals.SchDoc
size B; SheetNumber: 4; SheetTotal: 14
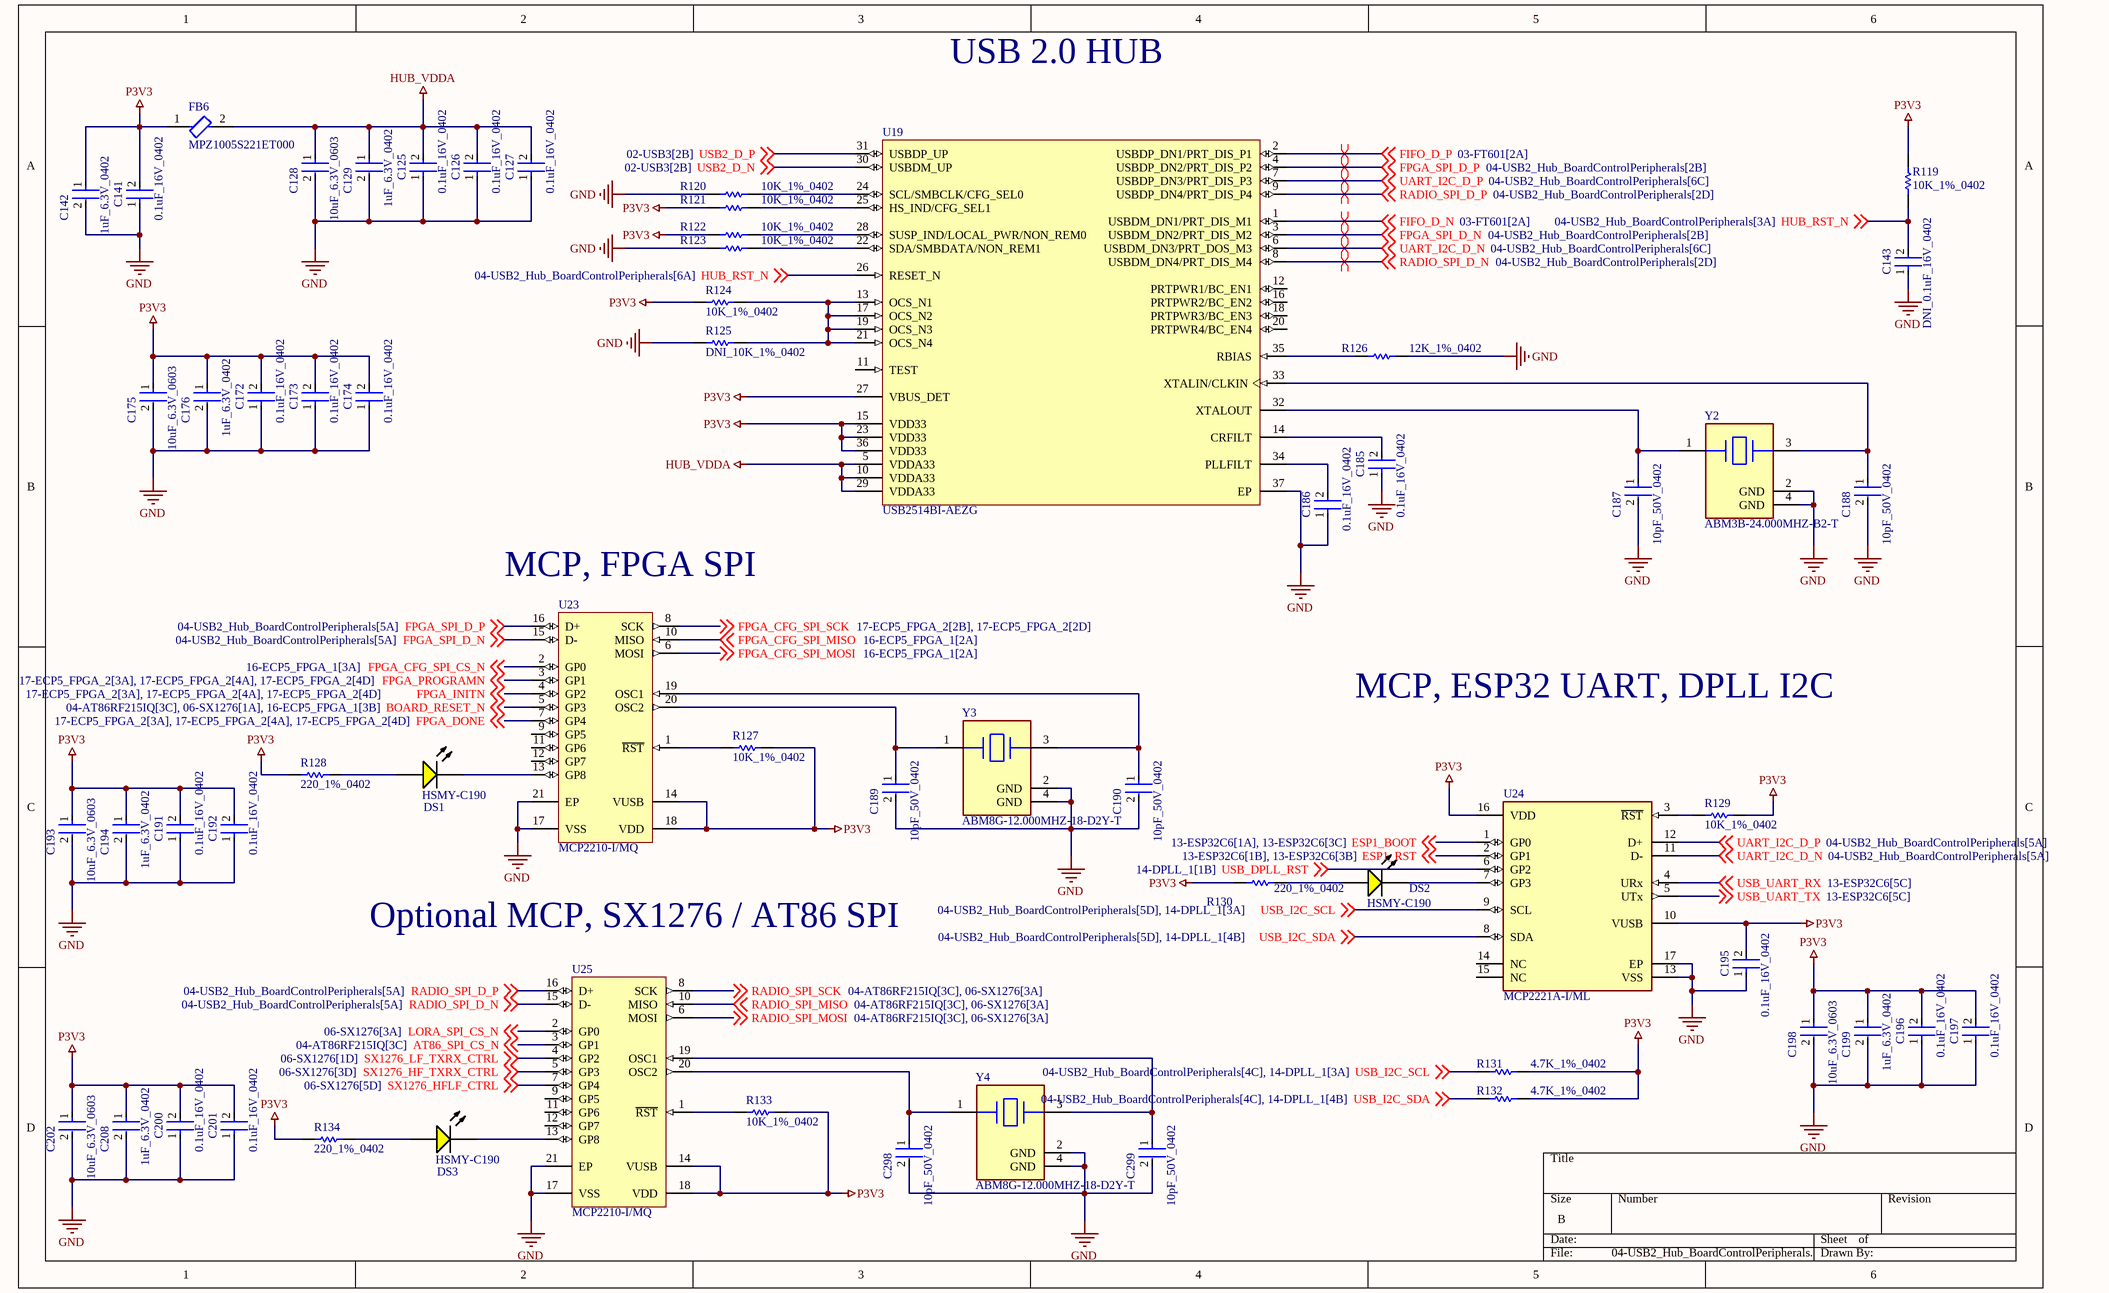
[diagram p3: 04-USB2_Hub_BoardControlPeripherals.SchDoc]

### Parts
C125  0.1uF_16V_0402  [FP-C0402-BB-MFG]
C126  0.1uF_16V_0402  [FP-C0402-BB-MFG]
C127  0.1uF_16V_0402  [FP-C0402-BB-MFG]
C128  10uF_6.3V_0603  [FP-GRM188-0_1-e0_2_0_55-IPC_A]
C129  1uF_6.3V_0402  [FP-CC0402-MFG]
C141  0.1uF_16V_0402  [FP-C0402-BB-MFG]
C142  1uF_6.3V_0402  [FP-CC0402-MFG]
C143  DNI_0.1uF_16V_0402  [FP-C0402-BB-MFG]  (no BOM)
C172  0.1uF_16V_0402  [FP-C0402-BB-MFG]
C173  0.1uF_16V_0402  [FP-C0402-BB-MFG]
C174  0.1uF_16V_0402  [FP-C0402-BB-MFG]
C175  10uF_6.3V_0603  [FP-GRM188-0_1-e0_2_0_55-IPC_A]
C176  1uF_6.3V_0402  [FP-CC0402-MFG]
C185  0.1uF_16V_0402  [FP-C0402-BB-MFG]
C186  0.1uF_16V_0402  [FP-C0402-BB-MFG]
C187  10pF_50V_0402  [FP-C0402-BB-MFG]
C188  10pF_50V_0402  [FP-C0402-BB-MFG]
C189  10pF_50V_0402  [FP-C0402-BB-MFG]
C190  10pF_50V_0402  [FP-C0402-BB-MFG]
C191  0.1uF_16V_0402  [FP-C0402-BB-MFG]
C192  0.1uF_16V_0402  [FP-C0402-BB-MFG]
C193  10uF_6.3V_0603  [FP-GRM188-0_1-e0_2_0_55-IPC_A]
C194  1uF_6.3V_0402  [FP-CC0402-MFG]
C195  0.1uF_16V_0402  [FP-C0402-BB-MFG]
C196  0.1uF_16V_0402  [FP-C0402-BB-MFG]
C197  0.1uF_16V_0402  [FP-C0402-BB-MFG]
C198  10uF_6.3V_0603  [FP-GRM188-0_1-e0_2_0_55-IPC_A]
C199  1uF_6.3V_0402  [FP-CC0402-MFG]
C200  0.1uF_16V_0402  [FP-C0402-BB-MFG]
C201  0.1uF_16V_0402  [FP-C0402-BB-MFG]
C202  10uF_6.3V_0603  [FP-GRM188-0_1-e0_2_0_55-IPC_A]
C208  1uF_6.3V_0402  [FP-CC0402-MFG]
C298  10pF_50V_0402  [FP-C0402-BB-MFG]
C299  10pF_50V_0402  [FP-C0402-BB-MFG]
DS1  HSMY-C190  [AVAG-HSMX-C190_V]
DS2  HSMY-C190  [AVAG-HSMX-C190_V]
DS3  HSMY-C190  [AVAG-HSMX-C190_V]
FB6  MPZ1005S221ET000  [FP-MPZ1005-IPC_A]
R119  10K_1%_0402  [RESC1005X40X25NL10T10]
R120  10K_1%_0402  [RESC1005X40X25NL10T10]
R121  10K_1%_0402  [RESC1005X40X25NL10T10]
R122  10K_1%_0402  [RESC1005X40X25NL10T10]
R123  10K_1%_0402  [RESC1005X40X25NL10T10]
R124  10K_1%_0402  [RESC1005X40X25NL10T10]
R125  DNI_10K_1%_0402  [RESC1005X40X25NL10T10]  (no BOM)
R126  12K_1%_0402  [RESC1005X40X25LL10T10]
R127  10K_1%_0402  [RESC1005X40X25NL10T10]
R128  220_1%_0402  [RESC1005X40X25LL05T05]
R129  10K_1%_0402  [RESC1005X40X25NL10T10]
R130  220_1%_0402  [RESC1005X40X25LL05T05]
R131  4.7K_1%_0402  [RESC1005X40X25NL05T10]
R132  4.7K_1%_0402  [RESC1005X40X25NL05T10]
R133  10K_1%_0402  [RESC1005X40X25NL10T10]
R134  220_1%_0402  [RESC1005X40X25LL05T05]
U19  USB2514BI-AEZG  [MCHP-QFN-36_V]
U23  MCP2210-I/MQ  [QFN-MQ20_L]
U24  MCP2221A-I/ML  [FP-C04-127-MFG]
U25  MCP2210-I/MQ  [QFN-MQ20_L]
Y2  ABM3B-24.000MHZ-B2-T  [FP-ABM3B-MFG]
Y3  ABM8G-12.000MHZ-18-D2Y-T  [FP-ABM8G-MFG]
Y4  ABM8G-12.000MHZ-18-D2Y-T  [FP-ABM8G-MFG]

### Nets
GND: C125.1 C126.1 C127.1 C128.2 C129.2 C141.1 C142.2 C143.1 C172.1 C173.1 C174.1 C175.2 C176.2 C185.1 C186.1 C187.2 C188.2 C189.2 C190.2 C191.1 C192.1 C193.2 C194.2 C195.1 C196.1 C197.1 C198.2 C199.2 C200.1 C201.1 C202.2 C208.2 C298.2 C299.2 R120.1 R123.1 R125.1 R126.2 U19.37(EP) U23.17(VSS) U23.21(EP) U24.13(VSS) U24.17(EP) U25.17(VSS) U25.21(EP) Y2.2(GND) Y2.4(GND) Y3.2(GND) Y3.4(GND) Y4.2(GND) Y4.4(GND)
HUB_VDDA: C125.2 C126.2 C127.2 C128.1 C129.1 FB6.2 U19.5(VDDA33) U19.10(VDDA33) U19.29(VDDA33)
P3V3: C141.2 C142.1 C172.2 C173.2 C174.2 C175.1 C176.1 C191.2 C192.2 C193.1 C194.1 C195.2 C196.2 C197.2 C198.1 C199.1 C200.2 C201.2 C202.1 C208.1 FB6.1 R119.2 R121.1 R122.1 R124.1 R127.2 R128.1 R129.2 R130.1 R131.2 R132.2 R133.2 R134.1 U19.15(VDD33) U19.23(VDD33) U19.27(VBUS_DET) U19.36(VDD33) U23.14(VUSB) U23.18(VDD) U24.10(VUSB) U24.16(VDD) U25.14(VUSB) U25.18(VDD)
AT86_SPI_CS_N: U25.3(GP1) ; off-sheet AT86_SPI_CS_N
BOARD_RESET_N: U23.5(GP3) ; off-sheet BOARD_RESET_N
ESP1_BOOT: U24.1(GP0) ; off-sheet ESP1_BOOT
ESP1_RST: U24.2(GP1) ; off-sheet ESP1_RST
FIFO_D_N: U19.1(USBDM_DN1/PRT_DIS_M1) ; off-sheet FIFO_D_N
FIFO_D_P: U19.2(USBDP_DN1/PRT_DIS_P1) ; off-sheet FIFO_D_P
FPGA_CFG_SPI_CS_N: U23.2(GP0) ; off-sheet FPGA_CFG_SPI_CS_N
FPGA_CFG_SPI_MISO: U23.10(MISO) ; off-sheet FPGA_CFG_SPI_MISO
FPGA_CFG_SPI_MOSI: U23.6(MOSI) ; off-sheet FPGA_CFG_SPI_MOSI
FPGA_CFG_SPI_SCK: U23.8(SCK) ; off-sheet FPGA_CFG_SPI_SCK
FPGA_DONE: U23.7(GP4) ; off-sheet FPGA_DONE
FPGA_INITN: U23.4(GP2) ; off-sheet FPGA_INITN
FPGA_PROGRAMN: U23.3(GP1) ; off-sheet FPGA_PROGRAMN
FPGA_SPI_D_N: U19.3(USBDM_DN2/PRT_DIS_M2) U23.15(D-) ; off-sheet FPGA_SPI_D_N
FPGA_SPI_D_P: U19.4(USBDP_DN2/PRT_DIS_P2) U23.16(D+) ; off-sheet FPGA_SPI_D_P
HUB_RST_N: C143.2 R119.1 U19.26(RESET_N) ; off-sheet HUB_RST_N
LORA_SPI_CS_N: U25.2(GP0) ; off-sheet LORA_SPI_CS_N
RADIO_SPI_D_N: U19.8(USBDM_DN4/PRT_DIS_M4) U25.15(D-) ; off-sheet RADIO_SPI_D_N
RADIO_SPI_D_P: U19.9(USBDP_DN4/PRT_DIS_P4) U25.16(D+) ; off-sheet RADIO_SPI_D_P
RADIO_SPI_MISO: U25.10(MISO) ; off-sheet RADIO_SPI_MISO
RADIO_SPI_MOSI: U25.6(MOSI) ; off-sheet RADIO_SPI_MOSI
RADIO_SPI_SCK: U25.8(SCK) ; off-sheet RADIO_SPI_SCK
SX1276_HF_TXRX_CTRL: U25.5(GP3) ; off-sheet SX1276_HF_TXRX_CTRL
SX1276_HFLF_CTRL: U25.7(GP4) ; off-sheet SX1276_HFLF_CTRL
SX1276_LF_TXRX_CTRL: U25.4(GP2) ; off-sheet SX1276_LF_TXRX_CTRL
UART_I2C_D_N: U19.6(USBDM_DN3/PRT_DOS_M3) U24.11(D-) ; off-sheet UART_I2C_D_N
UART_I2C_D_P: U19.7(USBDP_DN3/PRT_DIS_P3) U24.12(D+) ; off-sheet UART_I2C_D_P
USB2_D_N: U19.30(USBDM_UP) ; off-sheet USB2_D_N
USB2_D_P: U19.31(USBDP_UP) ; off-sheet USB2_D_P
USB_DPLL_RST: U24.6(GP2) ; off-sheet USB_DPLL_RST
USB_I2C_SCL: R131.1 U24.9(SCL) ; off-sheet USB_I2C_SCL
USB_I2C_SDA: R132.1 U24.8(SDA) ; off-sheet USB_I2C_SDA
USB_UART_RX: U24.4(URx) ; off-sheet USB_UART_RX
USB_UART_TX: U24.5(UTx) ; off-sheet USB_UART_TX
NetC185_2: C185.2 U19.14(CRFILT)
NetC186_2: C186.2 U19.34(PLLFILT)
NetC187_1: C187.1 U19.32(XTALOUT) Y2.1
NetC188_1: C188.1 U19.33(XTALIN/CLKIN) Y2.3
NetC189_1: C189.1 U23.20(OSC2) Y3.1
NetC190_1: C190.1 U23.19(OSC1) Y3.3
NetC298_1: C298.1 U25.20(OSC2) Y4.1
NetC299_1: C299.1 U25.19(OSC1) Y4.3
NetDS1_1: DS1.1(A) R128.2
NetDS1_2: DS1.2(K) U23.13(GP8)
NetDS2_1: DS2.1(A) R130.2
NetDS2_2: DS2.2(K) U24.7(GP3)
NetDS3_1: DS3.1(A) R134.2
NetDS3_2: DS3.2(K) U25.13(GP8)
NetR120_2: R120.2 U19.24(SCL/SMBCLK/CFG_SEL0)
NetR121_2: R121.2 U19.25(HS_IND/CFG_SEL1)
NetR122_2: R122.2 U19.28(SUSP_IND/LOCAL_PWR/NON_REM0)
NetR123_2: R123.2 U19.22(SDA/SMBDATA/NON_REM1)
NetR124_2: R124.2 R125.2 U19.13(OCS_N1) U19.17(OCS_N2) U19.19(OCS_N3) U19.21(OCS_N4)
NetR126_1: R126.1 U19.35(RBIAS)
NetR127_1: R127.1 U23.1(~{RST})
NetR129_1: R129.1 U24.3(~{RST})
NetR133_1: R133.1 U25.1(~{RST})

Not connected (* = marked no-connect by the designer): U19 11(TEST) 12(PRTPWR1/BC_EN1) 16(PRTPWR2/BC_EN2) 18(PRTPWR3/BC_EN3) 20(PRTPWR4/BC_EN4); U23 9(GP5) 11(GP6) 12(GP7); U24 14(NC) 15(NC); U25 9(GP5) 11(GP6) 12(GP7)

### Layout directives
differential pair: FIFO_D_N, FIFO_D_P, FPGA_SPI_D_N, FPGA_SPI_D_P, RADIO_SPI_D_N, RADIO_SPI_D_P, UART_I2C_D_N, UART_I2C_D_P

### Notes on the sheet
- USB 2.0 HUB
- (near U23) MCP, FPGA SPI
- MCP, ESP32 UART, DPLL I2C
- Optional MCP, SX1276 / AT86 SPI

### Library data of the parts
C125-C127 C141 C143 C172-C174 C185 C186 C191 C192 C195-C197 C200 C201 = CMP-1034-02068-3: as C68 on sheet 02-USB3; ComponentLink2URL: https://content.kemet.com/datasheets/KEM_C1002_X7R_SMD.pdf; Automotive: No; Device Class L2: Capacitors; Temperature: -55°C to +125°C; RoHS: TRUE; Voltage Rating: 16 V; ComponentLink2Description: Datasheet; Device Class L3: Ceramic Capacitors; Temperature Range Low: -55°C; Ipc Land Pattern Name: CAPC10050X50; Device Class L1: Passive Components; Temperature Range High: +125°C; Package: C0402-BB; Capacitance: 0.10 μF; Category: Cap; Mouser Description: CAP CER 0.1UF 16V X7R 0402; Height: 0.55mm; Digikey Description: CAP CER 0.1UF 16V 5% X7R 0402; Octopart: https://octopart.com/c0402c104j4ractu-kemet-12573893; Temperature Characteristic: X7R; Lead Free: Yes
C128 C175 C193 C198 C202 = CMP-2006-02792-2: as C81 on sheet 03-FT601; Packaging: Tape and Reel; Voltage Rating (DC): 6.3V; Width: 0.031inch; Termination: SMD/SMT; Dielectric: X5R; Package Quantity: 4000; Voltage Rating: 6.3V; Capacitance: 10uF; Case/Package: 0603; Min Operating Temperature: -55°C; Voltage: 6.3V; Length: 1.6mm; Thickness: 0.035inch; Lead Free: Lead Free; Depth: 0.8mm; Case Code (Imperial): 0603; Max Operating Temperature: 85°C; Material: Ceramic; Height: 0.8mm; Tolerance: 20%; Mount: Surface Mount; REACH SVHC: No SVHC; Radiation Hardening: No; Case Code (Metric): 1608
C129 C142 C176 C194 C199 C208 = CMP-2100-03591-2: as C82 on sheet 03-FT601; Voltage Rating: 6.3 V; Temperature Range Low: -55°C; Digikey Description: CAP CER 1UF 6.3V X5R 0402; Capacitance: 1 uF; Height: 0.55mm; Automotive: No; ComponentLink2URL: http://www.yageo.com/documents/recent/UPY-GP_NP0_16V-to-50V_16.pdf; Device Class L2: Capacitors; RoHS: TRUE; Temperature Range High: +125°C; Device Class L3: Ceramic Capacitors; Device Class L1: Passive Components; Temperature Characteristic: X5R; Package: CC0402; Octopart: https://octopart.com/cc0402krx5r5bb105-yageo-42244618; ComponentLink2Description: Datasheet; Temperature: -55°C to +125°C; Mouser Description: Multilayer Ceramic Capacitors MLCC - SMD/SMT 1uF 6.3V X5R 10%; Category: Cap; Footprint Url: http://www.yageo.com/exep/pages/download/literatures/UPY-C_GEN_24.pdf; Lead Free: Yes; Ipc Land Pattern Name: CAPC10050X50; Value: 1 uF
C187-C190 C298 C299 = CMP-2008-03404-2: as C95 on sheet 03-FT601; Automotive: No; Temperature Range High: +125°C; ComponentLink2Description: Datasheet; Material: Ceramic; Lead Free: Yes; ComponentLink2URL: https://content.kemet.com/datasheets/KEM_C1002_X7R_SMD.pdf; Device Class L3: Ceramic Capacitors; RoHS: TRUE; Package: C0402-BB; Temperature: -55°C to +125°C; Temperature Range Low: -55°C; Height: 0.55mm; Mouser Description: Multilayer Ceramic Capacitor, C Series, 10 Pf, - 5%, C0G / Np0, 50 V, 0402 [1005 Metric] Rohs Compliant: Yes; Octopart: https://octopart.com/c0402c100j5gactu-kemet-108448; Digikey Description: Multilayer Ceramic Capacitor, C Series, 10 Pf, - 5%, C0G / Np0, 50 V, 0402 [1005 Metric] Rohs Compliant: Yes; Temperature Characteristic: C0G; Category: Cap; Ipc Land Pattern Name: CAPC10050X50; Device Class L1: Passive Components; Device Class L2: Capacitors
DS1-DS3 = CMP-1744-00003-1: LED Uni-Color Yellow, 65 mW, 20 mA, -40 to 85 degC, 2-Pin SMD, RoHS, Tape and Reel; Tolerance: 1%; Voltage Rating: 50 V; Power Rating: 100 mW; Case\Package: 0603; Resistance: 390 Ohm; Min Operating Temperature: -55 degC; Length: 1.6 mm; ComponentLink3Description: Package Specification; Mount: Surface Mount; PackageReference: HSMX-C190; ComponentLink2Description: Datasheet; DatasheetVersion: Mar-12; Case Code (Metric): 1608; Pins: 2; Package Quantity: 5000; ComponentLink2URL: http://docs.avagotech.com/docs/AV02-0551EN; ComponentLink1Description: Manufacturer URL; RoHSCompliant: true; Packaging: Tape and Reel; PackageDescription: 2-Pin Surface Mount Device, Body 1.6 x 0.8 mm, Height 0.9 mm; REACH SVHC: No SVHC; ComponentLink3URL: http://www.fairchildsemi.com/dwg/MA/MA03D.pdf; Voltage Rating (DC): 50 V; Width: 0.8 mm; ComponentLink1URL: http://www.avagotech.com/; Max Operating Temperature: 155 degC; Case Code (Imperial): 0603; Height: 0.45 mm
FB6 = CMP-08257-000226-1: as FB4 on sheet 02-USB3; Mount: Surface Mount; Case Code (Metric): 1005; Height: 0.022inch; Min Operating Temperature: -55°C; Max Operating Temperature: 125°C; RoHS Compliant: Yes; Length: 0.039inch; Width: 0.02inch; Case Code (Imperial): 0402; Case/Package: 0402; Package Quantity: 10000; Max DC Current: 900mA; Core Material: Ferrite; Packaging: Tape and Reel
R119-R125 R127 R129 R133 = CMP-2002-04694-1: as R40 on sheet 02-USB3
R126 = CMP-2002-05686-1: Part Number: CRG0402F12K; Manufacturer: TE Connectivity / AMP
R128 R130 R134 = CMP-2002-01131-1: Manufacturer: Panasonic; Part Number: ERJ2RKF2200X
R131 R132 = CMP-1011-00586-2: as R116 on sheet 03-FT601
U19 = CMP-2000-05218-1: USB 2.0 Hi-Speed Hub Controller, 3 to 3.6 V, -40 to 85 degC, 36-Pin QFN, RoHS, Tape and Reel; Manufacturer: Microchip; Current - Supply: 85mA; Standards: USB2.0; Auxiliary Sense: -40degC~85degC; Other Names: Q5138631 / Q5487824 / Q7033177 / USB2514BIAEZG; Voltage - Supply: 3V~3.6V; Dynamic Catalog: USBControllers; Family: Interface-Controllers; Datasheet Version: Rev. 2.2, 02/2012; Quantity Available: Tube; Type: USB; Supplier Device Package: 36-QFN-EP(6x6); Operating Temperature: -40degC~85degC; Manufacturer URL: http://www.microchip.com/; Packaging: Tube; Interface: USB; Protocol: USB; Package / Case: 36-TQFNExposedPad; Datasheet URL: https://datasheet.ciiva.com/22650/1691496-22650784.pdf; Standard Package: 490; Minimum Quantity: USB; Category: IntegratedCircuits(ICs); Function: HubController; Internal Switch(s): 3V~3.6V
U23 U25 = CMP-0186-00190-1: USB-to-SPI Protocol Converter with GPIO (Master Mode), 20-Pin QFN, Industrial Temperature; PackageVersion: revBB, Aug-2009; ComponentLink3URL: http://www.microchip.com/stellent/groups/techpub_sg/documents/packagingspec/en012702.pdf; ComponentLink1Description: Manufacturer URL; ComponentLink1URL: http://www.microchip.com/; ComponentLink3Description: Package Specification; ComponentLink2URL: http://ww1.microchip.com/downloads/en/DeviceDoc/22288A.pdf; DatasheetVersion: revA, Dec-2011; ComponentLink2Description: Datasheet; PackageReference: QFN-MQ20; PackageDescription: 20-Lead Plastic Quad Flat, No Lead Package (MQ) - 5x5x0.9 mm Body [QFN]
U24 = CMP-06284-000031-1: IC USB TO I2C/UART 16QFN; Operating Supply Current: 13mA; Interface: I2C; Packaging: Rail/Tube; Case/Package: VQFN; Max Operating Temperature: 85°C; RoHS Compliant: Yes; Min Operating Temperature: -40°C
Y2 = CMP-1688-00008-2: Crystal 24MHz ±20ppm 18pF SMD-4 5mm x 3.2mm; ESR (Equivalent Series Resistance): 50R; Frequency Stability: 50ppm; Number of Pins: 4; Lead Free: Lead Free; Packaging: Tape and Reel; Tolerance: 20ppm; Series: ABM3B; Height: 0.043inch; Load Capacitance: 18pF; Length: 5mm; Depth: 3.2mm; Mount: Surface Mount; Resistor Type: Ceramic; Case/Package: CSMD; Termination: SMD/SMT; Width: 0.126inch; Frequency: 24MHz; Max Operating Temperature: 70°C; Frequency Tolerance: 20ppm; REACH SVHC: No SVHC; Package Quantity: 1000; Min Operating Temperature: -20°C; Series Resistance: 50R; Operating Frequency: 24 MHz
Y3 Y4 = CMP-2000-05039-3: Crystal 12MHz ±20ppm (Tol) ±30ppm (Stability) 18pF FUND 120Ω 4-Pin SMD T/R; Series Resistance: 120R; Max Operating Temperature: 85°C; Mount: Surface Mount; Width: 2.5mm; Series: ABM8G; Termination: SMD/SMT; Frequency Tolerance: 20ppm; Tolerance: 20ppm; Min Operating Temperature: -40°C; Operating Frequency: 12 MHz; Depth: 2.5mm; Load Capacitance: 18pF; Number of Pins: 4; Length: 3.2mm; Radiation Hardening: No; Frequency Stability: 30ppm; Height: 1mm; Packaging: Tape and Reel; Package Quantity: 1000; ESR (Equivalent Series Resistance): 120R; Lead Free: Lead Free; Frequency: 12MHz; Case/Package: CSMD